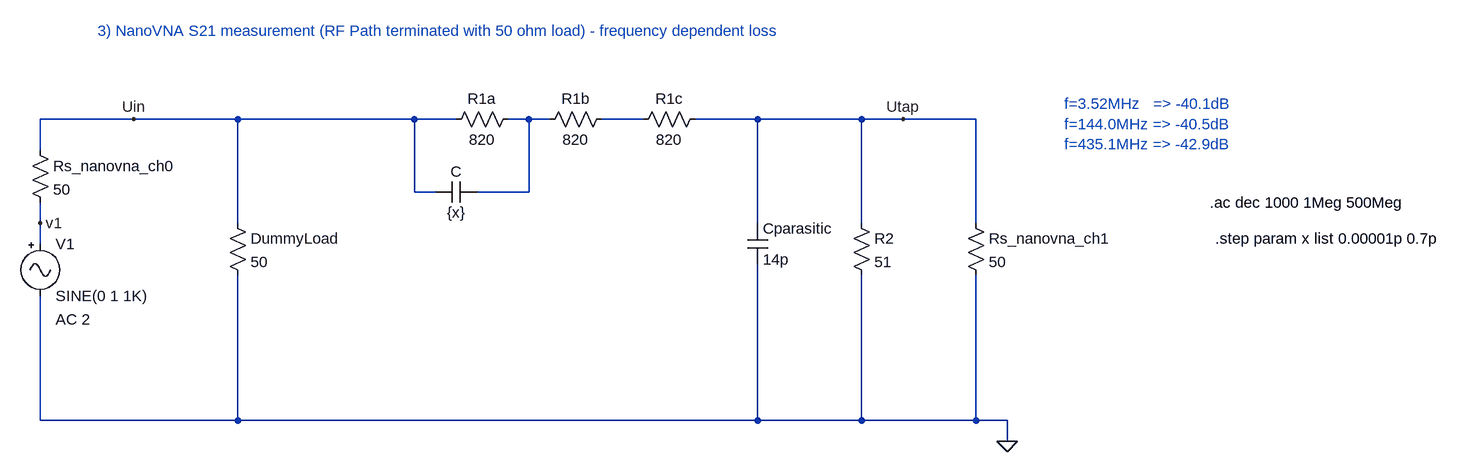
[diagram p0: schematic RFTap_v1_terminated_RF_Path_FreqDepLoss.asc]
RFTap_v1_terminated_RF_Path_FreqDepLoss.asc, the LTspice schematic file:
Version 4
SHEET 1 1764 1784
WIRE -3472 464 -3616 464
WIRE -3312 464 -3472 464
WIRE -3040 464 -3312 464
WIRE -2976 464 -3040 464
WIRE -2864 464 -2896 464
WIRE -2832 464 -2864 464
WIRE -2688 464 -2752 464
WIRE -2512 464 -2608 464
WIRE -2352 464 -2512 464
WIRE -2288 464 -2352 464
WIRE -2176 464 -2288 464
WIRE -3616 512 -3616 464
WIRE -3040 576 -3040 464
WIRE -3008 576 -3040 576
WIRE -2864 576 -2864 464
WIRE -2864 576 -2944 576
WIRE -3616 624 -3616 592
WIRE -3312 624 -3312 464
WIRE -2512 624 -2512 464
WIRE -2352 624 -2352 464
WIRE -2176 624 -2176 464
WIRE -3616 656 -3616 624
WIRE -3616 928 -3616 736
WIRE -3312 928 -3312 704
WIRE -3312 928 -3616 928
WIRE -2512 928 -2512 688
WIRE -2512 928 -3312 928
WIRE -2352 928 -2352 704
WIRE -2352 928 -2512 928
WIRE -2176 928 -2176 704
WIRE -2176 928 -2352 928
WIRE -2128 928 -2176 928
WIRE -2128 960 -2128 928
FLAG -2128 960 0
FLAG -3616 624 v1
FLAG -3472 464 Uin
FLAG -2288 464 Utap
SYMBOL Misc\\signal -3616 640 R0
WINDOW 123 24 132 Left 2
WINDOW 39 24 160 Left 2
SYMATTR Value2 AC 2
SYMATTR InstName V1
SYMBOL res -2192 608 R0
SYMATTR InstName Rs_nanovna_ch1
SYMATTR Value 50
SYMBOL res -3632 496 R0
SYMATTR InstName Rs_nanovna_ch0
SYMATTR Value 50
SYMBOL res -3328 608 R0
SYMATTR InstName DummyLoad
SYMATTR Value 50
SYMBOL res -2368 608 R0
SYMATTR InstName R2
SYMATTR Value 51
SYMBOL res -2880 448 R90
WINDOW 0 0 56 VBottom 2
WINDOW 3 32 56 VTop 2
SYMATTR InstName R1a
SYMATTR Value 820
SYMBOL cap -2528 624 R0
SYMATTR InstName Cparasitic
SYMATTR Value 14p
SYMBOL res -2736 448 R90
WINDOW 0 0 56 VBottom 2
WINDOW 3 32 56 VTop 2
SYMATTR InstName R1b
SYMATTR Value 820
SYMBOL res -2592 448 R90
WINDOW 0 0 56 VBottom 2
WINDOW 3 32 56 VTop 2
SYMATTR InstName R1c
SYMATTR Value 820
SYMBOL cap -2944 560 R90
WINDOW 0 0 32 VBottom 2
WINDOW 3 32 32 VTop 2
SYMATTR InstName C
SYMATTR Value {x}
TEXT -1816 592 Left 2 !.ac dec 1000 1Meg 500Meg
TEXT -3528 328 Left 2 ;3) NanoVNA S21 measurement (RF Path terminated with 50 ohm load) - frequency dependent loss
TEXT -2040 440 Left 2 ;f=3.52MHz   => -40.1dB\nf=144.0MHz => -40.5dB\nf=435.1MHz => -42.9dB
TEXT -1808 648 Left 2 !.step param x list 0.00001p 0.7p

The netlist it stands for:
* RFTap_v1_terminated_RF_Path_FreqDepLoss.asc
V1 v1 0 SINE(0 1 1K) AC 2
Rs_nanovna_ch1 Utap 0 50
Rs_nanovna_ch0 Uin v1 50
R§DummyLoad Uin 0 50
R2 Utap 0 51
R1a N001 Uin 820
Cparasitic Utap 0 14p
R1b N002 N001 820
R1c Utap N002 820
C N001 Uin {x}
.ac dec 1000 1Meg 500Meg
* 3) NanoVNA S21 measurement (RF Path terminated with 50 ohm load) - frequency dependent loss
* f=3.52MHz   => -40.1dB
* f=144.0MHz => -40.5dB
* f=435.1MHz => -42.9dB
.step param x list 0.00001p 0.7p
.backanno
.end